# Altium schematic sheet relay.SchDoc
size A3
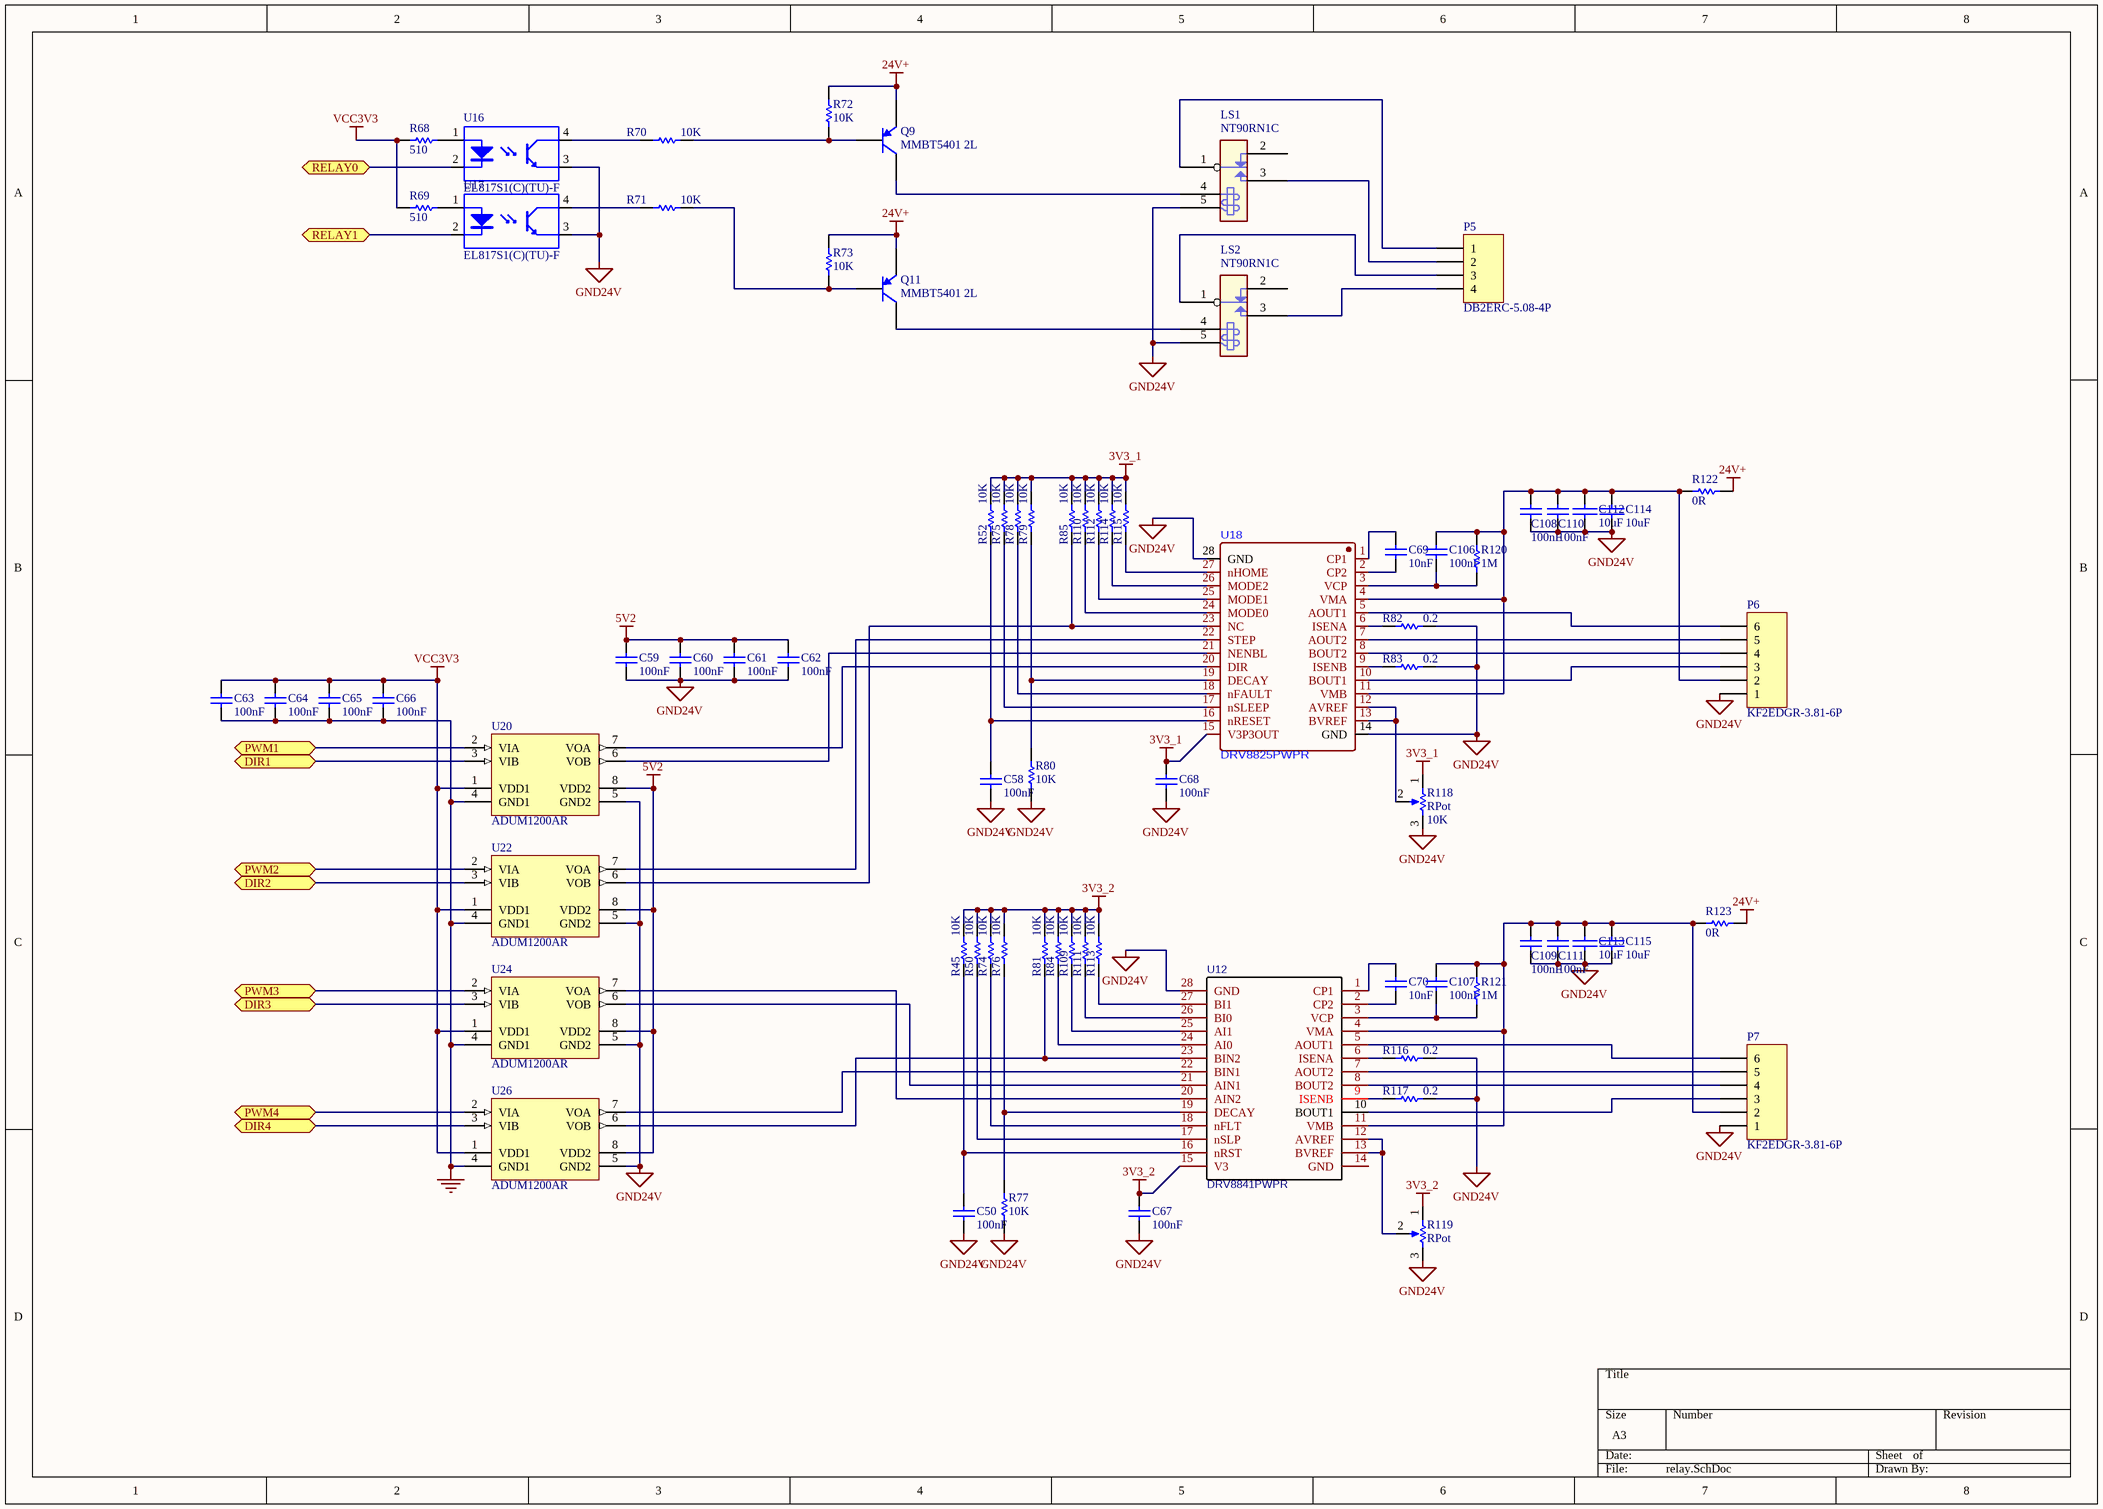
[diagram p0: relay.SchDoc]

## Parts
C50  100nF  [0805_C]
C58  100nF  [0805_C]
C59  100nF  [0805_C]
C60  100nF  [0805_C]
C61  100nF  [0805_C]
C62  100nF  [0805_C]
C63  100nF  [0805_C]
C64  100nF  [0805_C]
C65  100nF  [0805_C]
C66  100nF  [0805_C]
C67  100nF  [0805_C]
C68  100nF  [0805_C]
C69  10nF  [0805_C]
C70  10nF  [0805_C]
C106  100nF  [0805_C]
C107  100nF  [0805_C]
C108  100nF  [0805_C]
C109  100nF  [0805_C]
C110  100nF  [0805_C]
C111  100nF  [0805_C]
C112  10uF  [0805_C]
C113  10uF  [0805_C]
C114  10uF  [0805_C]
C115  10uF  [0805_C]
LS1  NT90RN1C  [NT90HCE12CE]
LS2  NT90RN1C  [NT90HCE12CE]
P5  DB2ERC-5.08-4P  [MSTBV 2.5/4-G-5.08]
P6  KF2EDGR-3.81-6P  [MC1.5/6-ST-3.81]
P7  KF2EDGR-3.81-6P  [MC1.5/6-ST-3.81]
Q9  MMBT5401 2L  [SOT-23(SOT-23-3)]
Q11  MMBT5401 2L  [SOT-23(SOT-23-3)]
R45  10K  [0805_R]
R50  10K  [0805_R]
R52  10K  [0805_R]
R68  510  [0805_R]
R69  510  [0805_R]
R70  10K  [0805_R]
R71  10K  [0805_R]
R72  10K  [0805_R]
R73  10K  [0805_R]
R74  10K  [0805_R]
R75  10K  [0805_R]
R76  10K  [0805_R]
R77  10K  [0805_R]
R78  10K  [0805_R]
R79  10K  [0805_R]
R80  10K  [0805_R]
R81  10K  [0805_R]
R82  0.2  [R1210]
R83  0.2  [R1210]
R84  10K  [0805_R]
R85  10K  [0805_R]
R109  10K  [0805_R]
R110  10K  [0805_R]
R111  10K  [0805_R]
R112  10K  [0805_R]
R113  10K  [0805_R]
R114  10K  [0805_R]
R115  10K  [0805_R]
R116  0.2  [R1210]
R117  0.2  [R1210]
R118  RPot  value 10K  [RES-ADJ-TH_3362P]
R119  RPot  [RES-ADJ-TH_3362P]
R120  1M  [0805_R]
R121  1M  [0805_R]
R122  0R  [0805_R]
R123  0R  [0805_R]
U12  DRV8841PWPR  [HTSSOP-28_L9.8-W4.5-P0.65-LS6.6-BL-EP]
U16  EL817S1(C)(TU)-F  [LC-SMD-4]
U17  EL817S1(C)(TU)-F  [LC-SMD-4]
U18  DRV8825PWPR  [HTSSOP_24P_L10.0-W4.4-P0.65-BL-EP]
U20  ADUM1200AR  [ADI-R-8_N]
U22  ADUM1200AR  [ADI-R-8_N]
U24  ADUM1200AR  [ADI-R-8_N]
U26  ADUM1200AR  [ADI-R-8_N]

## Ports
DIR1, DIR2, DIR3, DIR4, PWM1, PWM2, PWM3, PWM4, RELAY0, RELAY1

## Nets
3V3_1: C68.1 R52.1 R75.1 R78.1 R79.1 R85.1 R110.1 R112.1 R114.1 R115.1 R118.1(TOP) U18.15(V3P3OUT)
3V3_2: C67.1 R45.1 R50.1 R74.1 R76.1 R81.1 R84.1 R109.1 R111.1 R113.1 R119.1(TOP) U12.15(V3)
5V2: C59.2 C60.2 C61.2 C62.2 U20.8(VDD2) U22.8(VDD2) U24.8(VDD2) U26.8(VDD2)
24V+: Q9.2(E) Q11.2(E) R72.2 R73.2 R122.2 R123.2
GND: C63.1 C64.1 C65.1 C66.1 U20.4(GND1) U22.4(GND1) U24.4(GND1) U26.4(GND1)
GND24V: C50.2 C58.2 C59.1 C60.1 C61.1 C62.1 C67.2 C68.2 C108.1 C109.1 C110.1 C111.1 C112.1 C113.1 C114.1 C115.1 LS1.5(COIL2) LS2.5(COIL2) P6.1 P7.1 R77.2 R80.2 R82.1 R83.1 R116.1 R117.1 R118.3(BOT) R119.3(BOT) U12.28(GND) U16.3(E) U17.3(E) U18.14(GND) U18.28(GND) U20.5(GND2) U22.5(GND2) U24.5(GND2) U26.5(GND2)
VCC3V3: C63.2 C64.2 C65.2 C66.2 R68.2 R69.2 U20.1(VDD1) U22.1(VDD1) U24.1(VDD1) U26.1(VDD1)
DIR1: U20.3(VIB) ; port DIR1
DIR2: U22.3(VIB) ; port DIR2
DIR3: U24.3(VIB) ; port DIR3
DIR4: U26.3(VIB) ; port DIR4
PWM1: U20.2(VIA) ; port PWM1
PWM2: U22.2(VIA) ; port PWM2
PWM3: U24.2(VIA) ; port PWM3
PWM4: U26.2(VIA) ; port PWM4
RELAY0: U16.2(K) ; port RELAY0
RELAY1: U17.2(K) ; port RELAY1
NetC50_1: C50.1 R45.2 U12.16(nRST)
NetC58_1: C58.1 R52.2 U18.16(nRESET)
NetC69_1: C69.1 U18.1(CP1)
NetC69_2: C69.2 U18.2(CP2)
NetC70_1: C70.1 U12.1(CP1)
NetC70_2: C70.2 U12.2(CP2)
NetC106_1: C106.1 R120.2 U18.3(VCP)
NetC106_2: C106.2 C108.2 C110.2 C112.2 C114.2 P6.2 R120.1 R122.1 U18.4(VMA) U18.11(VMB)
NetC107_1: C107.1 R121.2 U12.3(VCP)
NetC107_2: C107.2 C109.2 C111.2 C113.2 C115.2 P7.2 R121.1 R123.1 U12.4(VMA) U12.11(VMB)
NetLS1_1: LS1.1(COMMON) P5.1
NetLS1_3: LS1.3(NO) P5.2
NetLS1_4: LS1.4(COIL1) Q9.3(C)
NetLS2_1: LS2.1(COMMON) P5.3
NetLS2_3: LS2.3(NO) P5.4
NetLS2_4: LS2.4(COIL1) Q11.3(C)
NetP6_3: P6.3 U18.10(BOUT1)
NetP6_4: P6.4 U18.8(BOUT2)
NetP6_5: P6.5 U18.7(AOUT2)
NetP6_6: P6.6 U18.5(AOUT1)
NetP7_3: P7.3 U12.10(BOUT1)
NetP7_4: P7.4 U12.8(BOUT2)
NetP7_5: P7.5 U12.7(AOUT2)
NetP7_6: P7.6 U12.5(AOUT1)
NetQ9_1: Q9.1(B) R70.2 R72.1
NetQ11_1: Q11.1(B) R71.2 R73.1
NetR50_2: R50.2 U12.17(nSLP)
NetR68_1: R68.1 U16.1(A)
NetR69_1: R69.1 U17.1(A)
NetR70_1: R70.1 U16.4(C)
NetR71_1: R71.1 U17.4(C)
NetR74_2: R74.2 U12.18(nFLT)
NetR75_2: R75.2 U18.17(nSLEEP)
NetR76_2: R76.2 R77.1 U12.19(DECAY)
NetR78_2: R78.2 U18.18(nFAULT)
NetR79_2: R79.2 R80.1 U18.19(DECAY)
NetR81_2: R81.2 U12.23(BIN2) U26.6(VOB)
NetR82_2: R82.2 U18.6(ISENA)
NetR83_2: R83.2 U18.9(ISENB)
NetR84_2: R84.2 U12.24(AI0)
NetR85_2: R85.2 U18.23(NC) U22.6(VOB)
NetR109_2: R109.2 U12.25(AI1)
NetR110_2: R110.2 U18.24(MODE0)
NetR111_2: R111.2 U12.26(BI0)
NetR112_2: R112.2 U18.25(MODE1)
NetR113_2: R113.2 U12.27(BI1)
NetR114_2: R114.2 U18.26(MODE2)
NetR115_2: R115.2 U18.27(nHOME)
NetR116_2: R116.2 U12.6(ISENA)
NetR117_2: R117.2 U12.9(ISENB)
NetR118_2: R118.2(TAP) U18.12(AVREF) U18.13(BVREF)
NetR119_2: R119.2(TAP) U12.12(AVREF) U12.13(BVREF)
NetU12_20: U12.20(AIN2) U24.7(VOA)
NetU12_21: U12.21(AIN1) U24.6(VOB)
NetU12_22: U12.22(BIN1) U26.7(VOA)
NetU18_20: U18.20(DIR) U20.7(VOA)
NetU18_21: U18.21(NENBL) U20.6(VOB)
NetU18_22: U18.22(STEP) U22.7(VOA)

Not connected (* = marked no-connect by the designer): LS1 2(NC); LS2 2(NC); U12 14(GND)

## Library data of the parts
C50 C58-C70 C106-C111 = 0805 100nF(104) 10% 50V: 贴片电容; ComponentLink1Description: 供应商链接; ComponentLink1URL: http://www.szlcsc.com/product/details_50686.html; Package: 0805; Supplier: LC; SuppliersPartNumber: C49678
C112-C115 = CC: Capacitor
P5 = Header 4H: Header, 4-Pin, Right Angle; LatestRevisionDate: 17-Jul-2002; LatestRevisionNote: Re-released for DXP Platform.; Publisher: Altium Limited
P6 P7 = Header 6: Header, 6-Pin; LatestRevisionDate: 17-Jul-2002; LatestRevisionNote: Re-released for DXP Platform.; Publisher: Altium Limited
Q9 Q11 = SOT-23 MMBT5401 2L: 三极管; ComponentLink1Description: 供应商链接; ComponentLink1URL: http://www.szlcsc.com/product/details_8818.html; Package: SOT-23; Supplier: LC; SuppliersPartNumber: C8326
R45 R50 R52 R68-R85 R109-R117 R120-R123 = Res1: Resistor; Value: 1K; Published: 8-Jun-2000; LatestRevisionDate: 17-Jul-2002; LatestRevisionNote: Re-released for DXP Platform.; PackageReference: AXIAL-0.3; Publisher: Altium Limited
R118 R119 = RPot: Potentiometer; Sim Note: Enter the Resistance value and the set point into parameter fields.; Set Position: 0.5; Published: 8-Jun-2000; LatestRevisionDate: 17-Jul-2002; LatestRevisionNote: Re-released for DXP Platform.; PackageReference: VR5; Publisher: Altium Limited; PackageDescription: Variable Resistor, Thru-Hole; 3 Leads
U12 = DRV8841PWPR: BOM_Manufacturer: TI; SMT Type: Extend; BOM_Supplier: LCSC; BOM_Manufacturer Part: DRV8841PWPR; image: //image.lceda.cn/szlcsc/C36542.jpg; BOM_Supplier Part: C36542; BOM_LCSC Assembly: Yes; spicePre: U; spiceSymbolName: DRV8841PWPR
U16 U17 = TLP521: Text Field1: 80; Text Field2: 50
U20 U22 U24 U26 = ADUM1200AR: Dual Channel Digital Isolator, 2.5 KV rms Insulation Rating, 1 Mbps Data Rate, 150 ns Delay, Industrial, 8-pin SOIC (R-8), Tube; Manufacturer: Analog Devices; Insulation Rating (kVrms): 2.5; Max Data Rate: 1Mbps; DatasheetVersion: Rev. I; PackageVersion: 060506-A, 06/2006; PackageReference: R-8; PackageDescription: 8-Pin Standard Small Outline Package, Body 4.9 x 3.9 mm, Pitch 1.27 mm; Supplier 1: Digi-Key; Supplier Part Number 1: ADUM1200AR-ND; Supplier 2: Mouser; Supplier Part Number 2: 584-ADUM1200AR; Max Operating Temp (degreesC): 125; Mounting Technology: Surface Mount; Code_JEDEC: MS-012-AA; PartNumber: ADUM1200AR; ComponentLink1Description: Manufacturer URL; ComponentLink1URL: http://www.analog.com/en/index.html; ComponentLink2Description: Datasheet; ComponentLink2URL: http://www.analog.com/static/imported-files/data_sheets/ADuM1200_1201.pdf; ComponentLink3Description: Package Specification; ComponentLink3URL: http://www.analog.com/static/imported-files/packages/PKG_PDF/SOIC_Narrow%20(R)/R_8.pdf; ComponentLink4Description: URL Link1; ComponentLink4URL: Product URL:http://www.analog.com/en/interface-isolation/digital-isolators/adum1200/products/product.html